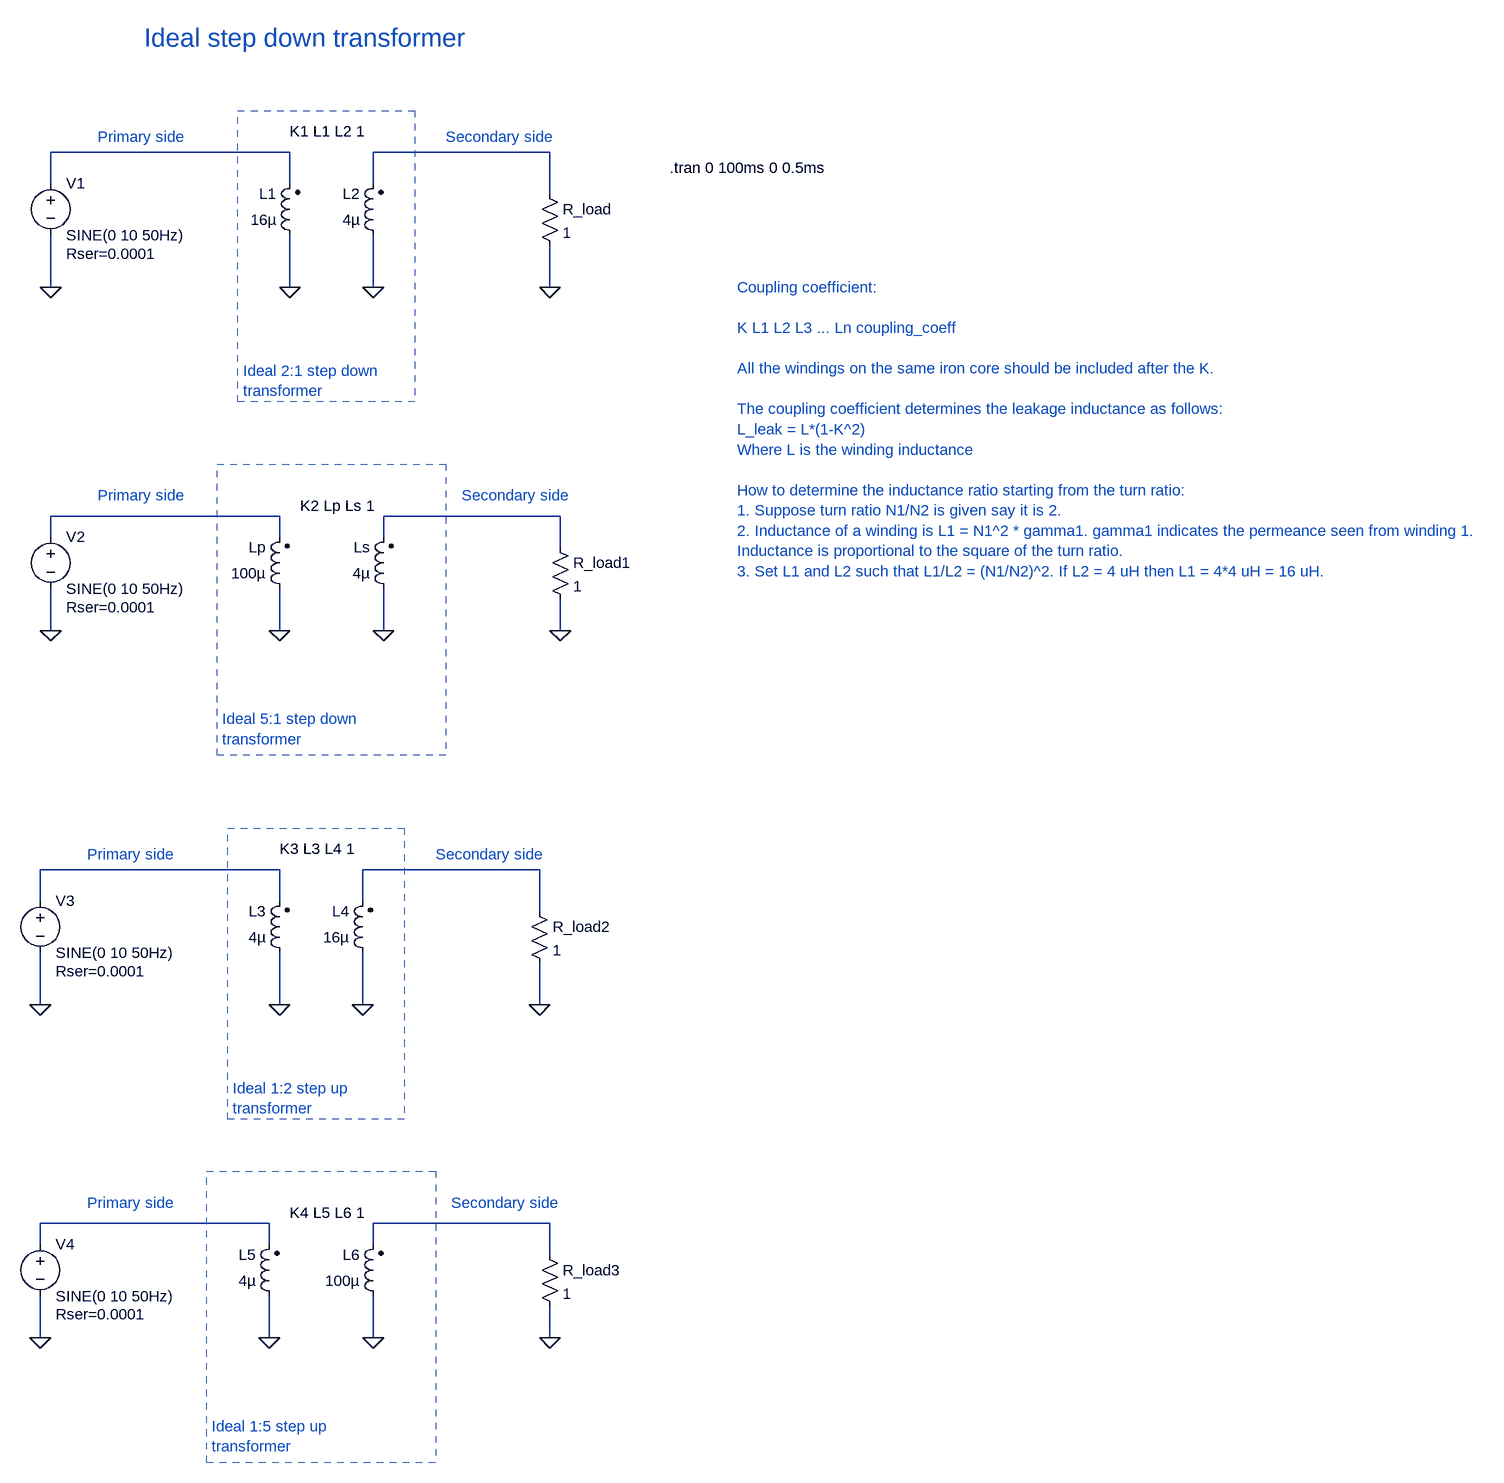
[diagram p0: schematic Transformer-step-down-up.asc]
Transformer-step-down-up.asc, the LTspice schematic file:
Version 4.1
SHEET 1 2356 2484
WIRE 240 -32 -128 -32
WIRE 640 -32 368 -32
WIRE -128 16 -128 -32
WIRE 240 16 240 -32
WIRE 368 16 368 -32
WIRE 640 32 640 -32
WIRE -128 176 -128 96
WIRE 240 176 240 96
WIRE 368 176 368 96
WIRE 640 176 640 112
WIRE 224 528 -128 528
WIRE 656 528 384 528
WIRE -128 560 -128 528
WIRE 224 560 224 528
WIRE 384 560 384 528
WIRE 656 576 656 528
WIRE -128 704 -128 640
WIRE 224 704 224 640
WIRE 384 704 384 640
WIRE 656 704 656 656
WIRE 224 1072 -144 1072
WIRE 624 1072 352 1072
WIRE -144 1120 -144 1072
WIRE 224 1120 224 1072
WIRE 352 1120 352 1072
WIRE 624 1136 624 1072
WIRE -144 1280 -144 1200
WIRE 224 1280 224 1200
WIRE 352 1280 352 1200
WIRE 624 1280 624 1216
WIRE 208 1616 -144 1616
WIRE 640 1616 368 1616
WIRE -144 1648 -144 1616
WIRE 208 1648 208 1616
WIRE 368 1648 368 1616
WIRE 640 1664 640 1616
WIRE -144 1792 -144 1728
WIRE 208 1792 208 1728
WIRE 368 1792 368 1728
WIRE 640 1792 640 1744
FLAG -128 176 0
FLAG 240 176 0
FLAG 368 176 0
FLAG 640 176 0
FLAG -128 704 0
FLAG 224 704 0
FLAG 384 704 0
FLAG 656 704 0
FLAG -144 1280 0
FLAG 224 1280 0
FLAG 352 1280 0
FLAG 624 1280 0
FLAG -144 1792 0
FLAG 208 1792 0
FLAG 368 1792 0
FLAG 640 1792 0
SYMBOL voltage -128 0 R0
WINDOW 123 0 0 Left 2
WINDOW 39 24 124 Left 2
SYMATTR SpiceLine Rser=0.0001
SYMATTR InstName V1
SYMATTR Value SINE(0 10 50Hz)
SYMBOL ind2 256 112 R180
WINDOW 0 36 80 Left 2
WINDOW 3 36 40 Left 2
SYMATTR InstName L1
SYMATTR Value 16µ
SYMATTR Type ind
SYMBOL ind2 384 112 R180
WINDOW 0 36 80 Left 2
WINDOW 3 36 40 Left 2
SYMATTR InstName L2
SYMATTR Value 4µ
SYMATTR Type ind
SYMBOL res 624 16 R0
SYMATTR InstName R_load
SYMATTR Value 1
SYMBOL ind2 240 656 R180
WINDOW 0 36 80 Left 2
WINDOW 3 36 40 Left 2
SYMATTR InstName Lp
SYMATTR Value 100µ
SYMATTR Type ind
SYMBOL ind2 400 656 R180
WINDOW 0 36 80 Left 2
WINDOW 3 36 40 Left 2
SYMATTR InstName Ls
SYMATTR Value 4µ
SYMATTR Type ind
SYMBOL res 640 560 R0
SYMATTR InstName R_load1
SYMATTR Value 1
SYMBOL voltage -128 544 R0
WINDOW 123 0 0 Left 2
WINDOW 39 24 124 Left 2
SYMATTR SpiceLine Rser=0.0001
SYMATTR InstName V2
SYMATTR Value SINE(0 10 50Hz)
SYMBOL voltage -144 1104 R0
WINDOW 123 0 0 Left 2
WINDOW 39 24 124 Left 2
SYMATTR SpiceLine Rser=0.0001
SYMATTR InstName V3
SYMATTR Value SINE(0 10 50Hz)
SYMBOL ind2 240 1216 R180
WINDOW 0 36 80 Left 2
WINDOW 3 36 40 Left 2
SYMATTR InstName L3
SYMATTR Value 4µ
SYMATTR Type ind
SYMBOL ind2 368 1216 R180
WINDOW 0 36 80 Left 2
WINDOW 3 36 40 Left 2
SYMATTR InstName L4
SYMATTR Value 16µ
SYMATTR Type ind
SYMBOL res 608 1120 R0
SYMATTR InstName R_load2
SYMATTR Value 1
SYMBOL ind2 224 1744 R180
WINDOW 0 36 80 Left 2
WINDOW 3 36 40 Left 2
SYMATTR InstName L5
SYMATTR Value 4µ
SYMATTR Type ind
SYMBOL ind2 384 1744 R180
WINDOW 0 36 80 Left 2
WINDOW 3 36 40 Left 2
SYMATTR InstName L6
SYMATTR Value 100µ
SYMATTR Type ind
SYMBOL res 624 1648 R0
SYMATTR InstName R_load3
SYMATTR Value 1
SYMBOL voltage -144 1632 R0
WINDOW 123 0 0 Left 2
WINDOW 39 24 124 Left 2
SYMATTR SpiceLine Rser=0.0001
SYMATTR InstName V4
SYMATTR Value SINE(0 10 50Hz)
TEXT 240 -64 Left 2 !K1 L1 L2 1
TEXT 824 -8 Left 2 !.tran 0 100ms 0 0.5ms
TEXT 16 -208 Left 4 ;Ideal step down transformer
TEXT 168 304 Left 2 ;Ideal 2:1 step down\ntransformer
TEXT 256 512 Left 2 !K2 Lp Ls 1
TEXT 136 840 Left 2 ;Ideal 5:1 step down\ntransformer
TEXT -56 -56 Left 2 ;Primary side
TEXT 480 -56 Left 2 ;Secondary side
TEXT 928 176 Left 2 ;Coupling coefficient:\n \nK L1 L2 L3 ... Ln coupling_coeff\n \nAll the windings on the same iron core should be included after the K.\n \nThe coupling coefficient determines the leakage inductance as follows:\nL_leak = L*(1-K^2)\nWhere L is the winding inductance\n \nHow to determine the inductance ratio starting from the turn ratio:\n1. Suppose turn ratio N1/N2 is given say it is 2.\n2. Inductance of a winding is L1 = N1^2 * gamma1. gamma1 indicates the permeance seen from winding 1.\nInductance is proportional to the square of the turn ratio.\n3. Set L1 and L2 such that L1/L2 = (N1/N2)^2. If L2 = 4 uH then L1 = 4*4 uH = 16 uH.
TEXT 224 1040 Left 2 !K3 L3 L4 1
TEXT 152 1408 Left 2 ;Ideal 1:2 step up\ntransformer
TEXT -72 1048 Left 2 ;Primary side
TEXT 464 1048 Left 2 ;Secondary side
TEXT -56 496 Left 2 ;Primary side
TEXT 504 496 Left 2 ;Secondary side
TEXT 240 1600 Left 2 !K4 L5 L6 1
TEXT 120 1928 Left 2 ;Ideal 1:5 step up\ntransformer
TEXT -72 1584 Left 2 ;Primary side
TEXT 488 1584 Left 2 ;Secondary side
RECTANGLE Normal 432 352 160 -96 2
RECTANGLE Normal 480 896 128 448 2
RECTANGLE Normal 416 1456 144 1008 2
RECTANGLE Normal 464 1984 112 1536 2

The netlist it stands for:
* Transformer-step-down-up.asc
V1 N001 0 SINE(0 10 50Hz) Rser=0.0001
L1 0 N001 16µ
L2 0 N002 4µ
R_load N002 0 1
Lp 0 N003 100µ
Ls 0 N004 4µ
R_load1 N004 0 1
V2 N003 0 SINE(0 10 50Hz) Rser=0.0001
V3 N005 0 SINE(0 10 50Hz) Rser=0.0001
L3 0 N005 4µ
L4 0 N006 16µ
R_load2 N006 0 1
L5 0 N007 4µ
L6 0 N008 100µ
R_load3 N008 0 1
V4 N007 0 SINE(0 10 50Hz) Rser=0.0001
K1 L1 L2 1
.tran 0 100ms 0 0.5ms
* Ideal step down transformer
* Ideal 2:1 step down
* transformer
K2 Lp Ls 1
* Ideal 5:1 step down
* transformer
* Primary side
* Secondary side
* Coupling coefficient:
* K L1 L2 L3 ... Ln coupling_coeff
* All the windings on the same iron core should be included after the K.
* The coupling coefficient determines the leakage inductance as follows:
* L_leak = L*(1-K^2)
* Where L is the winding inductance
* How to determine the inductance ratio starting from the turn ratio:
* 1. Suppose turn ratio N1/N2 is given say it is 2.
* 2. Inductance of a winding is L1 = N1^2 * gamma1. gamma1 indicates the permeance seen from winding 1.
* Inductance is proportional to the square of the turn ratio.
* 3. Set L1 and L2 such that L1/L2 = (N1/N2)^2. If L2 = 4 uH then L1 = 4*4 uH = 16 uH.
K3 L3 L4 1
* Ideal 1:2 step up
* transformer
* Primary side
* Secondary side
* Primary side
* Secondary side
K4 L5 L6 1
* Ideal 1:5 step up
* transformer
* Primary side
* Secondary side
.backanno
.end